# Altium project bms_mainboard-1_0.PrjPcb (part 4 of 7)

## Sheet usb_usb2534.SchDoc
size B
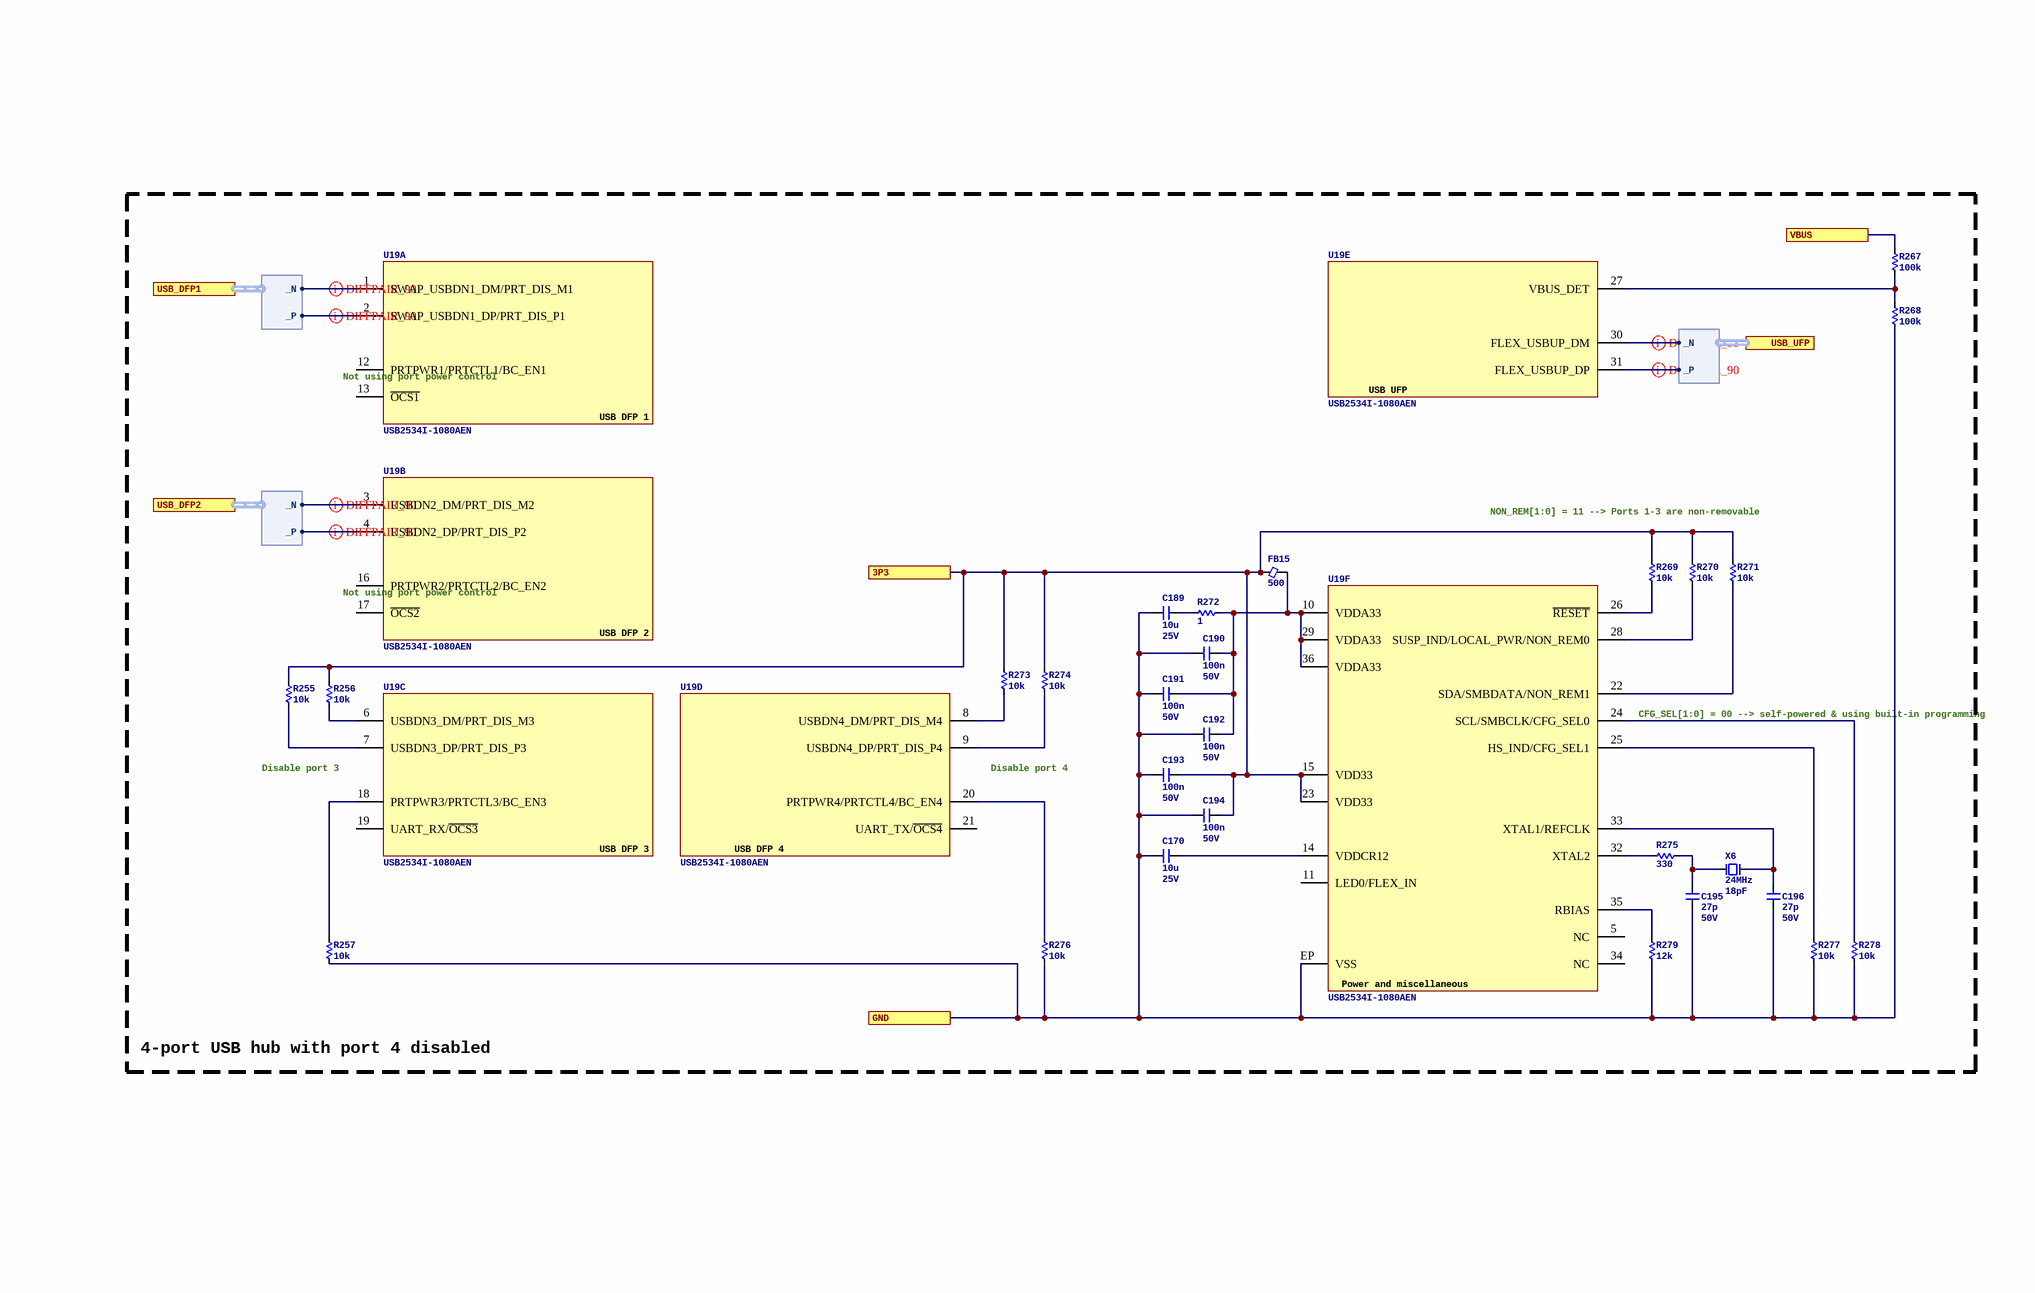
[diagram p16: usb_usb2534.SchDoc]

### Parts
C170  Capacitance: 10u  Voltage Rating: 25V  [C0603]  (hidden comment: CL10A106MA8NRNC)
C189  Capacitance: 10u  Voltage Rating: 25V  [C0805]  (hidden comment: CL21B106KAYQNNE)
C190  Capacitance: 100n  Voltage Rating: 50V  [C0402]  (hidden comment: CL05B104KB54PNC)
C191  Capacitance: 100n  Voltage Rating: 50V  [C0402]  (hidden comment: CL05B104KB54PNC)
C192  Capacitance: 100n  Voltage Rating: 50V  [C0402]  (hidden comment: CL05B104KB54PNC)
C193  Capacitance: 100n  Voltage Rating: 50V  [C0402]  (hidden comment: CL05B104KB54PNC)
C194  Capacitance: 100n  Voltage Rating: 50V  [C0402]  (hidden comment: CL05B104KB54PNC)
C195  Capacitance: 27p  Voltage Rating: 50V  [C0402]  (hidden comment: 0402CG270J500NT)
C196  Capacitance: 27p  Voltage Rating: 50V  [C0402]  (hidden comment: 0402CG270J500NT)
FB15  Current Rating (mA): 500  [FB0402]  (hidden comment: BLM15AX601SN1D)
R255  value 10k  [R0402]  (hidden comment: 0402WGF1002TCE)
R256  value 10k  [R0402]  (hidden comment: 0402WGF1002TCE)
R257  value 10k  [R0402]  (hidden comment: 0402WGF1002TCE)
R267  value 100k  [R0402]  (hidden comment: 0402WGF1003TCE)
R268  value 100k  [R0402]  (hidden comment: 0402WGF1003TCE)
R269  value 10k  [R0402]  (hidden comment: 0402WGF1002TCE)
R270  value 10k  [R0402]  (hidden comment: 0402WGF1002TCE)
R271  value 10k  [R0402]  (hidden comment: 0402WGF1002TCE)
R272  value 1  [R0402]  (hidden comment: CRCW04021R00FKED)
R273  value 10k  [R0402]  (hidden comment: 0402WGF1002TCE)
R274  value 10k  [R0402]  (hidden comment: 0402WGF1002TCE)
R275  value 330  [R0402]  (hidden comment: 0402WGF3300TCE)
R276  value 10k  [R0402]  (hidden comment: 0402WGF1002TCE)
R277  value 10k  [R0402]  (hidden comment: 0402WGF1002TCE)
R278  value 10k  [R0402]  (hidden comment: 0402WGF1002TCE)
R279  value 12k  [R0402]  (hidden comment: 0402WGF1202TCE)
U19  USB2534I-1080AEN  [QFN50P600X600X90-36N]  (parts A,B,C,D,E,F of 6)
X6  Frequency: 24MHz  Load Capacitance: 18pF  [XTAL_TXC_7A]  (hidden comment: 7A-24.000MAAJ-T)

### Ports
3P3, GND, USB_DFP1 (harness DIFF), USB_DFP2 (harness DIFF), USB_UFP (harness DIFF), VBUS

### Harnesses
DIFF: _N, _P

### Nets
3P3_USB: C193.1 C194.1 FB15.1 R255.1 R256.1 R269.1 R270.1 R271.1 R273.1 R274.1 U19.15(VDD33) U19.23(VDD33) ; port 3P3
GND: C170.2 C189.2 C190.2 C191.2 C192.2 C193.2 C194.2 C195.2 C196.2 R257.2 R268.1 R276.2 R277.2 R278.2 R279.2 U19.EP(VSS) ; port GND
VBUS: R267.1 ; port VBUS
USB_DFP1._N: U19.1(SWAP_USBDN1_DM/PRT_DIS_M1) ; port USB_DFP1._N
USB_DFP1._P: U19.2(SWAP_USBDN1_DP/PRT_DIS_P1) ; port USB_DFP1._P
USB_DFP2._N: U19.3(USBDN2_DM/PRT_DIS_M2) ; port USB_DFP2._N
USB_DFP2._P: U19.4(USBDN2_DP/PRT_DIS_P2) ; port USB_DFP2._P
USB_UFP._N: U19.30(FLEX_USBUP_DM) ; port USB_UFP._N
USB_UFP._P: U19.31(FLEX_USBUP_DP) ; port USB_UFP._P
NetC170_1: C170.1 U19.14(VDDCR12)
NetC189_1: C189.1 R272.2
NetC190_1: C190.1 C191.1 C192.1 FB15.2 R272.1 U19.10(VDDA33) U19.29(VDDA33) U19.36(VDDA33)
NetC195_1: C195.1 R275.1 X6.1
NetC196_1: C196.1 U19.33(XTAL1/REFCLK) X6.2
NetR255_2: R255.2 U19.7(USBDN3_DP/PRT_DIS_P3)
NetR256_2: R256.2 U19.6(USBDN3_DM/PRT_DIS_M3)
NetR257_1: R257.1 U19.18(PRTPWR3/PRTCTL3/BC_EN3)
NetR267_2: R267.2 R268.2 U19.27(VBUS_DET)
NetR269_2: R269.2 U19.26(~{RESET})
NetR270_2: R270.2 U19.28(SUSP_IND/LOCAL_PWR/NON_REM0)
NetR271_2: R271.2 U19.22(SDA/SMBDATA/NON_REM1)
NetR273_2: R273.2 U19.8(USBDN4_DM/PRT_DIS_M4)
NetR274_2: R274.2 U19.9(USBDN4_DP/PRT_DIS_P4)
NetR275_2: R275.2 U19.32(XTAL2)
NetR276_1: R276.1 U19.20(PRTPWR4/PRTCTL4/BC_EN4)
NetR277_1: R277.1 U19.25(HS_IND/CFG_SEL1)
NetR278_1: R278.1 U19.24(SCL/SMBCLK/CFG_SEL0)
NetR279_1: R279.1 U19.35(RBIAS)

Not connected (* = marked no-connect by the designer): U19 5(NC) 11(LED0/FLEX_IN) 12(PRTPWR1/PRTCTL1/BC_EN1) 13(~{OCS1}) 16(PRTPWR2/PRTCTL2/BC_EN2) 17(~{OCS2}) 19(UART_RX/~{OCS3}) 21(UART_TX/~{OCS4}) 34(NC)

### Layout directives
differential pair; differential pair class DE_90: USB_DFP1._N, USB_DFP1._P, USB_DFP2._N, USB_DFP2._P, USB_UFP._N, USB_UFP._P

### Notes on the sheet
- (near U19) Not using port power control
- NON_REM[1:0] = 11 --> Ports 1-3 are non-removable
- Disable port 3
- (near U19) Disable port 4
- (near U19) CFG_SEL[1:0] = 00 --> self-powered & using built-in programming
- 4-port USB hub with port 4 disabled
- (in symbol USB_HUB_4PORT_USB2534I-1080AEN, part A) USB DFP 1
- (in symbol USB_HUB_4PORT_USB2534I-1080AEN, part B) USB DFP 2
- (in symbol USB_HUB_4PORT_USB2534I-1080AEN, part C) USB DFP 3
- (in symbol USB_HUB_4PORT_USB2534I-1080AEN, part D) USB DFP 4
- (in symbol USB_HUB_4PORT_USB2534I-1080AEN, part E) USB UFP
- (in symbol USB_HUB_4PORT_USB2534I-1080AEN, part F) Power and miscellaneous
- (in symbol USB2534I-1080AEN, part A) USB DFP 1
- (in symbol USB2534I-1080AEN, part B) USB DFP 2
- (in symbol USB2534I-1080AEN, part C) USB DFP 3
- (in symbol USB2534I-1080AEN, part D) USB DFP 4
- (in symbol USB2534I-1080AEN, part E) USB UFP
- (in symbol USB2534I-1080AEN, part F) Power and miscellaneous

### Library data of the parts
C170 = CL10A106MA8NRNC: as C85 on sheet current_mp6519; ComponentLink1URL: https://wmsc.lcsc.com/wmsc/upload/file/pdf/v2/lcsc/2304140030_Samsung-Electro-Mechanics-CL10A106MA8NRNC_C96446.pdf; ComponentLink1Description: Datasheet; Manufacturer Part Number: CL10A106MA8NRNC; Package: 0603; Supplier 2: LCSC; Supplier Part Number 2: C96446
C189 = CL21B106KAYQNNE: as C38 on sheet adc_mcp3913; ComponentLink1URL: https://datasheet.lcsc.com/lcsc/2206222030_Samsung-Electro-Mechanics-CL21B106KAYQNNE_C3039694.pdf; ComponentLink1Description: Datasheet; Manufacturer Part Number: CL21B106KAYQNNE; Package: 0805; Supplier 2: LCSC; Supplier Part Number 2: C3039694
C190-C194 = CL05B104KB54PNC: as C37 on sheet adc_mcp3913; ComponentLink1URL: https://wmsc.lcsc.com/wmsc/upload/file/pdf/v2/lcsc/2304140030_Samsung-Electro-Mechanics-CL05B104KB54PNC_C307331.pdf; ComponentLink1Description: Datasheet; Manufacturer Part Number: CL05B104KB54PNC; Package: 0402; Supplier 2: LCSC; Supplier Part Number 2: C307331
C195 C196 = 0402CG270J500NT: as C34-C36 on sheet adc_mcp3913; ComponentLink1URL: https://wmsc.lcsc.com/wmsc/upload/file/pdf/v2/lcsc/2304140030_FH--Guangdong-Fenghua-Advanced-Tech-0402CG270J500NT_C1557.pdf; ComponentLink1Description: Datasheet; Manufacturer Part Number: 0402CG270J500NT; Package: 0402; Supplier 2: LCSC; Supplier Part Number 2: C1557
FB15 = BLM15AX601SN1D: as FB3 on sheet adc_mcp3913; ComponentLink1URL: https://wmsc.lcsc.com/wmsc/upload/file/pdf/v2/lcsc/2304140030_Murata-Electronics-BLM15AX601SN1D_C76886.pdf; ComponentLink1Description: Datasheet; Manufacturer Part Number: BLM15AX601SN1D; Supplier 2: LCSC; Supplier Part Number 2: C76886; Package: 0402
R255-R257 R269-R271 R273 R274 R276-R278 = 0402WGF1002TCE: as R75 on sheet adc_mcp3913; ComponentLink1Description: Datasheet; ComponentLink1URL: https://wmsc.lcsc.com/wmsc/upload/file/pdf/v2/lcsc/2206010100_UNI-ROYAL-Uniroyal-Elec-0402WGF1002TCE_C25744.pdf; Manufacturer Part Number: 0402WGF1002TCE; Package: 0402; Supplier 2: LCSC; Supplier Part Number 2: C25744
R267 R268 = 0402WGF1003TCE: as R141 on sheet current_mp6519; ComponentLink1Description: Datasheet; ComponentLink1URL: https://wmsc.lcsc.com/wmsc/upload/file/pdf/v2/lcsc/2206010100_UNI-ROYAL-Uniroyal-Elec-0402WGF1003TCE_C25741.pdf; Manufacturer Part Number: 0402WGF1003TCE; Package: 0402; Supplier 2: LCSC; Supplier Part Number 2: C25741
R272 = CRCW04021R00FKED: as R78 on sheet adc_mcp3913; ComponentLink1Description: Datasheet; ComponentLink1URL: https://wmsc.lcsc.com/wmsc/upload/file/pdf/v2/lcsc/2211030200_Vishay-Intertech-CRCW04021R00FKED_C482087.pdf; Manufacturer Part Number: CRCW04021R00FKED; Package: 0402; Supplier 2: LCSC; Supplier Part Number 2: C482087
R275 = 0402WGF3300TCE: Manufacturer: UNI-ROYAL(Uniroyal Elec); Tolerance: 1%; Temperature Coefficient: Â±100ppm/â„ƒ; Power Rating (mW): 62.5; ComponentLink1Description: Datasheet; ComponentLink1URL: https://wmsc.lcsc.com/wmsc/upload/file/pdf/v2/lcsc/2205311900_UNI-ROYAL-Uniroyal-Elec-0402WGF3300TCE_C25104.pdf; Manufacturer Part Number: 0402WGF3300TCE; Package: 0402; Supplier 2: LCSC; Supplier Part Number 2: C25104
R279 = 0402WGF1202TCE: Manufacturer: UNI-ROYAL(Uniroyal Elec); Tolerance: 1%; Temperature Coefficient: Â±100ppm/â„ƒ; Power Rating (mW): 62.5; ComponentLink1Description: Datasheet; ComponentLink1URL: https://wmsc.lcsc.com/wmsc/upload/file/pdf/v2/lcsc/2411221127_UNI-ROYAL-Uniroyal-Elec-0402WGF1202TCE_C25752.pdf; Manufacturer Part Number: 0402WGF1202TCE; Package: 0402; Supplier 2: LCSC; Supplier Part Number 2: C25752
U19 = USB_HUB_4PORT_USB2534I-1080AEN: USB Bus Controller, CMOS; Manufacturer: Microchip; Supplier 1: Digikey; Supplier Part Number 1: USB2534I-1080AEN-ND; Manufacturer Part Number: USB2534I-1080AEN; ComponentLink1Description: Datasheet; ComponentLink1URL: https://ww1.microchip.com/downloads/aemDocuments/documents/UNG/ProductDocuments/DataSheets/USB2534-Data-Sheet-DS00001713.pdf; ComponentLink2Description: Product page; ComponentLink2URL: https://www.microchip.com/en-us/product/USB2534; Supplier 2: LCSC; Supplier Part Number 2: C626674
X6 = XTAL_7A-24.000MAAJ-T: CRYSTAL 24.000 MHZ 18PF SMD; Manufacturer: TXC CORPORATION; Supplier 1: Digikey; ComponentLink1URL: http://www.txccrystal.com/images/pdf/7a.pdf; ComponentLink1Description: Datasheet; Supplier Part Number 1: 887-1090-1-ND; Manufacturer Part Number: 7A-24.000MAAJ-T; Supplier 2: LCSC; Supplier Part Number 2: C2450230

## Sheet conn_usbc.SchDoc
size A
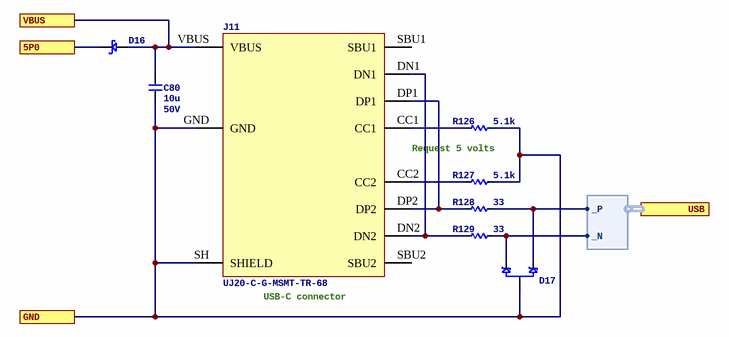
[diagram p17: conn_usbc.SchDoc]

### Parts
C80  Capacitance: 10u  Voltage Rating: 50V  [C1206]  (hidden comment: CL31B106KBHNNNE)
D16  MSS2P2-M3/89A  [ESMP]  (value not drawn)
D17  PESD2USB3UX  [3SOT23]  (value not drawn)
J11  UJ20-C-G-MSMT-TR-68  [CONN_USBC_UJ20-C-G-MSMT-TR-68]
R126  value 5.1k  [R0402]  (hidden comment: 0402WGF5101TCE)
R127  value 5.1k  [R0402]  (hidden comment: 0402WGF5101TCE)
R128  value 33  [R0402]  (hidden comment: 0402WGF330JTCE)
R129  value 33  [R0402]  (hidden comment: 0402WGF330JTCE)

### Ports
5P0, GND, USB (harness DIFF), VBUS

### Harnesses
DIFF: _P, _N

### Nets
5P0: D16.1 ; port 5P0
GND: C80.2 D17.3 J11.GND J11.SH(SHIELD) R126.1 R127.1 ; port GND
VBUS: C80.1 D16.2 J11.VBUS ; port VBUS
USB_UFP._N: D17.1 R129.1 ; port USB._N
USB_UFP._P: D17.2 R128.1 ; port USB._P
NetJ11_CC1: J11.CC1 R126.2
NetJ11_CC2: J11.CC2 R127.2
NetJ11_DN1: J11.DN1 J11.DN2 R129.2
NetJ11_DP1: J11.DP1 J11.DP2 R128.2

Not connected (* = marked no-connect by the designer): J11 SBU1 SBU2

### Notes on the sheet
- Request 5 volts
- (near J11) USB-C connector

### Library data of the parts
C80 = CL31B106KBHNNNE: Manufacturer: Samsung Electro-Mechanics; Dielectric: X7R; ComponentLink1URL: https://wmsc.lcsc.com/wmsc/upload/file/pdf/v2/lcsc/1810221111_Samsung-Electro-Mechanics-CL31B106KBHNNNE_C89632.pdf; ComponentLink1Description: Datasheet; Manufacturer Part Number: CL31B106KBHNNNE; Package: 1206; Supplier 2: LCSC; Supplier Part Number 2: C89632
D16 = SCHOTTKY_MSS2P2-M3/89A: as D20 on sheet current_mp6519; Supplier 1: Digikey; Manufacturer Part Number: MSS2P2-M3/89A; ComponentLink1URL: http://www.vishay.com/docs/89054/mss2p3.pdf; ComponentLink1Description: Datasheet; Supplier Part Number 1: MSS2P2-M3/89AGICT-ND; Supplier 2: LCSC; Supplier Part Number 2: C2978531
D17 = TVS_PESD2USB3UX-T: DIODE ESD USB SOT-23; Manufacturer: Nexperia USA Inc.; Supplier 1: Digikey; Supplier Part Number 1: 1727-PESD2USB3UX-CT-ND; Manufacturer Part Number: PESD2USB3UX; Supplier 2: LCSC; Supplier Part Number 2: C3708426; ComponentLink1Description: Datasheet; ComponentLink1URL: https://assets.nexperia.com/documents/data-sheet/PESD2USB3UX-T.pdf
J11 = CONN_USBC_UJ20-C-G-MSMT-TR-68: USB-C (USB TYPE-C) USB 2.0 Receptacle Connector 24 (16+8 Dummy) Position Surface Mount, Right Angle; Through Hole; Manufacturer: Same Sky; ComponentLink1Description: Product page; ComponentLink1URL: https://www.sameskydevices.com/product/interconnect/connectors/usb-connectors/uj20-c-g-msmt-tr-68; ComponentLink2Description: Drawing; ComponentLink2URL: https://www.sameskydevices.com/product/resource/uj20-c-g-msmt-tr-68.pdf; Supplier 1: Digikey; Supplier Part Number 1: 2223-UJ20-C-G-MSMT-TR-68CT-ND; Manufacturer Part Number: UJ20-C-G-MSMT-TR-68; Supplier 2: LCSC; Supplier Part Number 2: C21943923
R126 R127 = 0402WGF5101TCE: Manufacturer: UNI-ROYAL(Uniroyal Elec); Tolerance: 1%; Temperature Coefficient: Â±100ppm/â„ƒ; Power Rating (mW): 62.5; ComponentLink1Description: Datasheet; ComponentLink1URL: https://wmsc.lcsc.com/wmsc/upload/file/pdf/v2/lcsc/2206010045_UNI-ROYAL-Uniroyal-Elec-0402WGF5101TCE_C25905.pdf; Manufacturer Part Number: 0402WGF5101TCE; Package: 0402; Supplier 2: LCSC; Supplier Part Number 2: C25905
R128 R129 = 0402WGF330JTCE: as R74 on sheet adc_mcp3913; ComponentLink1Description: Datasheet; ComponentLink1URL: https://wmsc.lcsc.com/wmsc/upload/file/pdf/v2/lcsc/2205311900_UNI-ROYAL-Uniroyal-Elec-0402WGF330JTCE_C25105.pdf; Manufacturer Part Number: 0402WGF330JTCE; Package: 0402; Supplier 2: LCSC; Supplier Part Number 2: C25105

## Sheet st-link-v2.SchDoc
size C
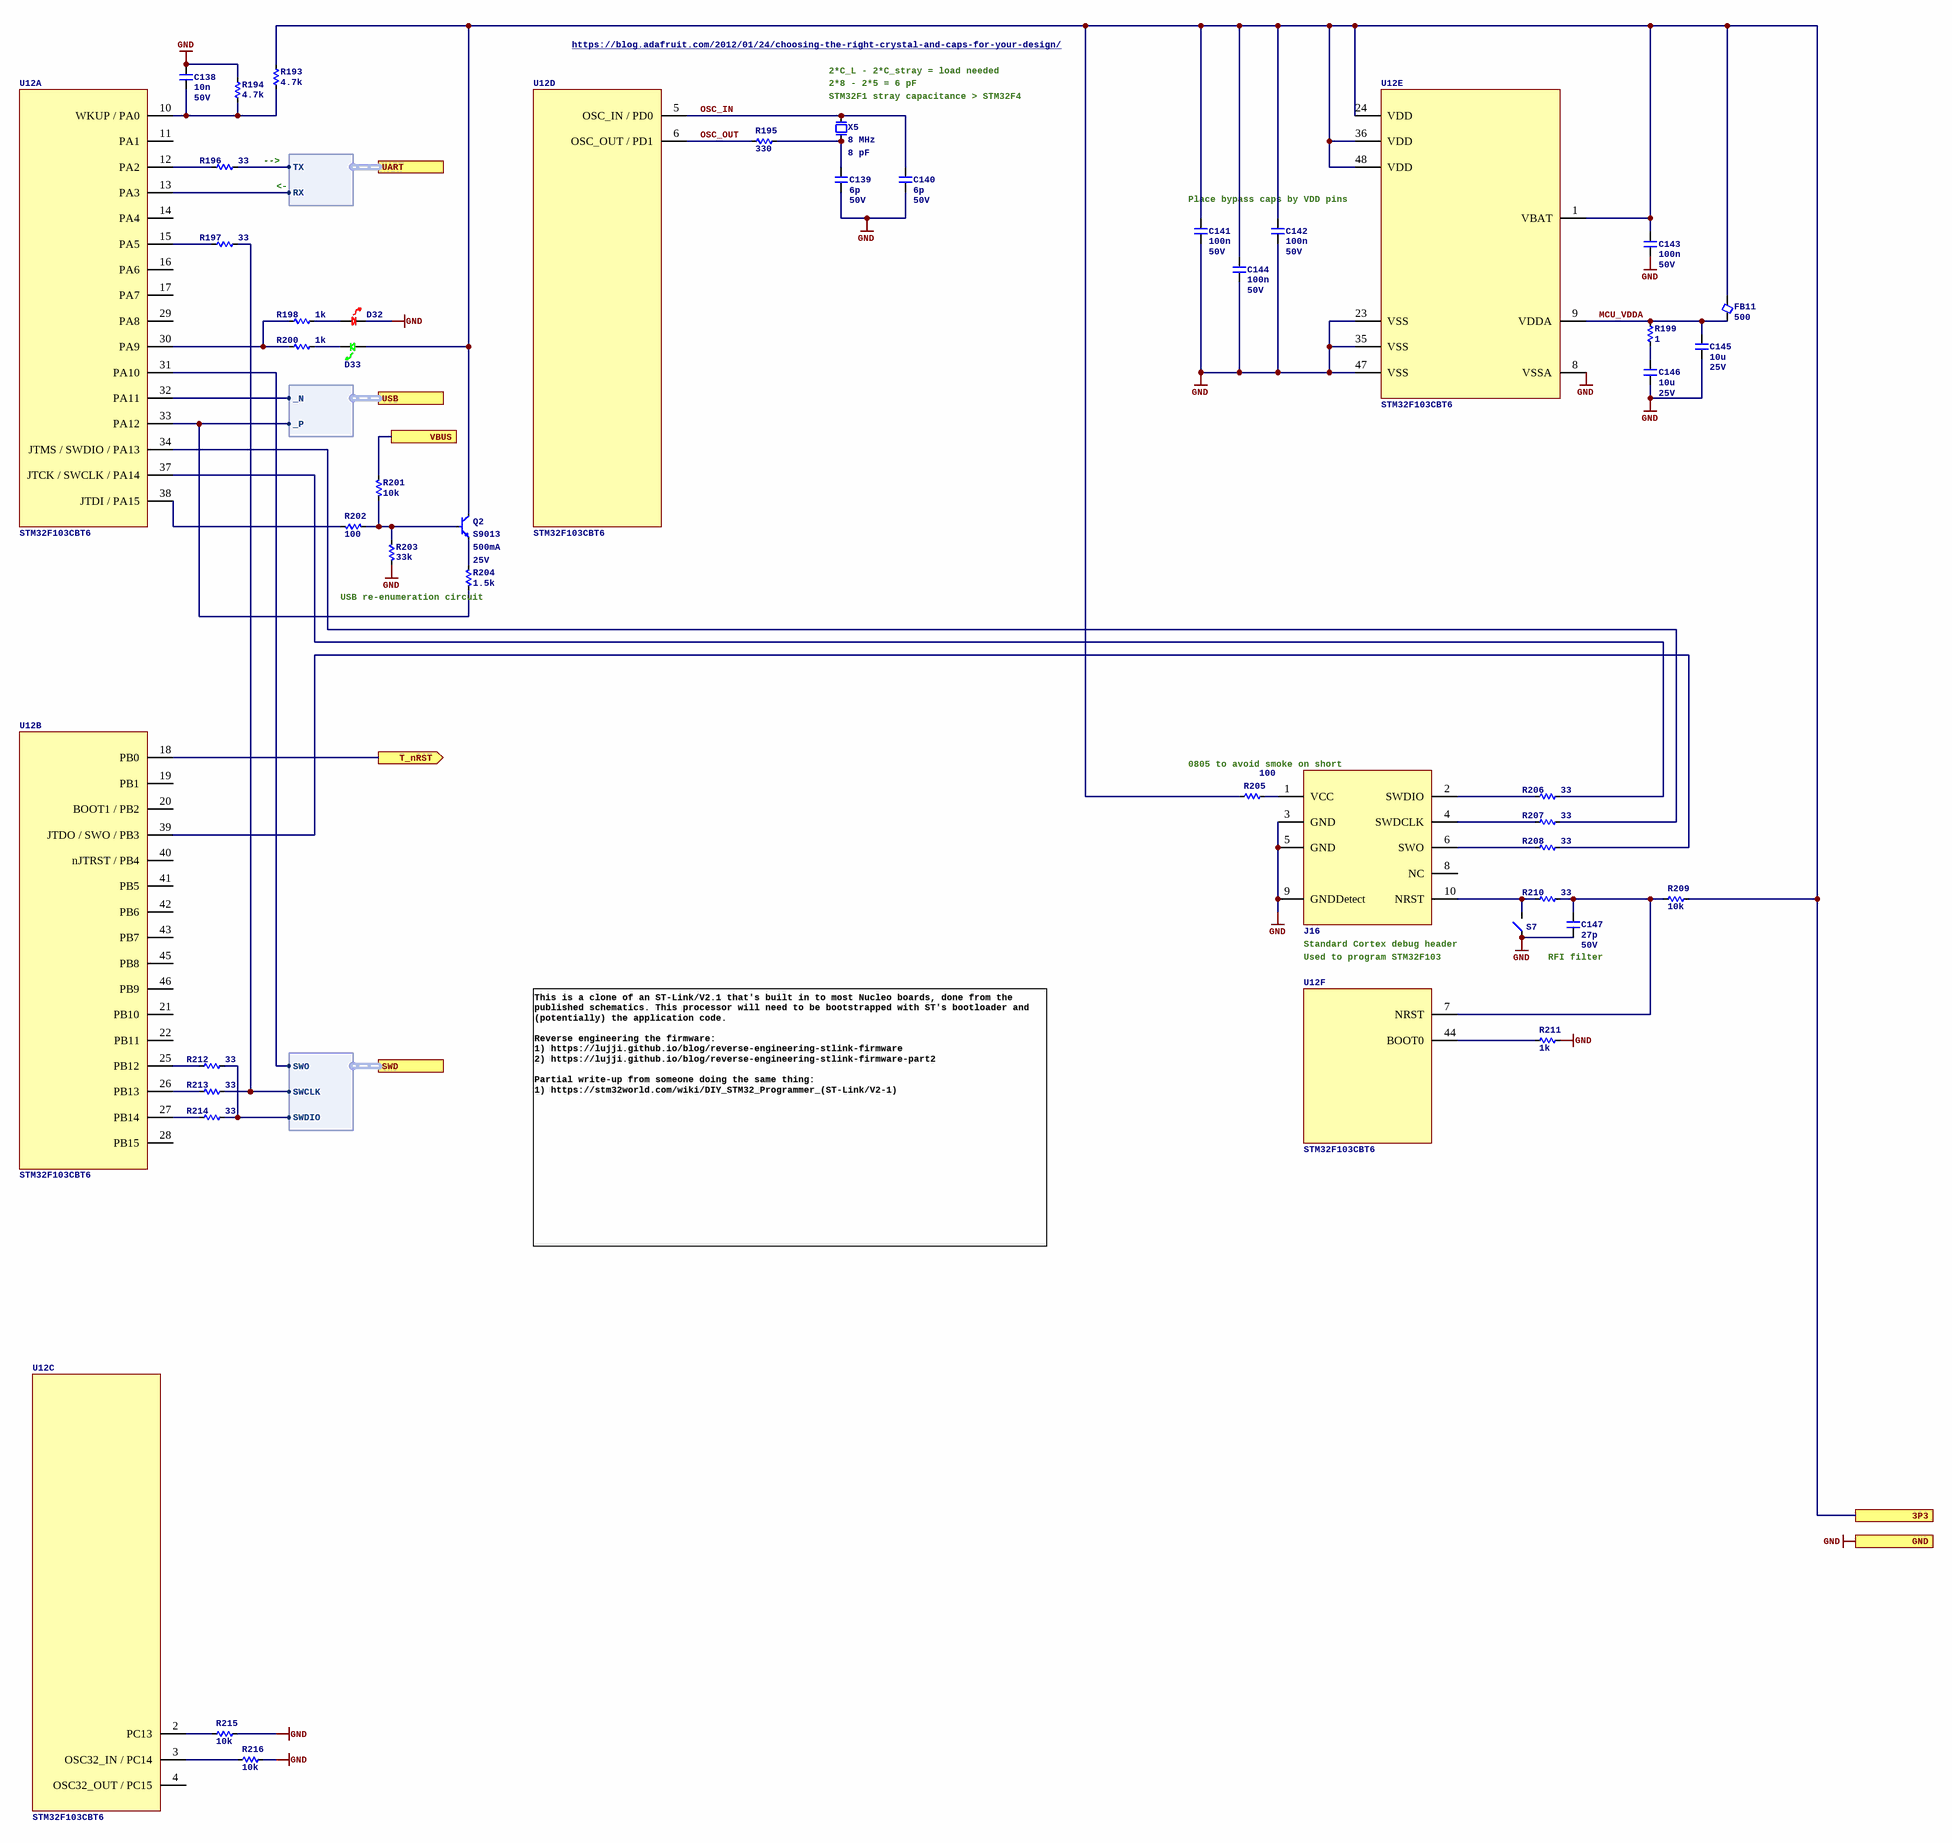
[diagram p18: st-link-v2.SchDoc]

### Parts
C138  Capacitance: 10n  Voltage Rating: 50V  [C0402]  (hidden comment: CL05B103KB5NNNC)
C139  Capacitance: 6p  Voltage Rating: 50V  [C0402]  (hidden comment: 0402CG6R0C500NT)
C140  Capacitance: 6p  Voltage Rating: 50V  [C0402]  (hidden comment: 0402CG6R0C500NT)
C141  Capacitance: 100n  Voltage Rating: 50V  [C0402]  (hidden comment: CL05B104KB54PNC)
C142  Capacitance: 100n  Voltage Rating: 50V  [C0402]  (hidden comment: CL05B104KB54PNC)
C143  Capacitance: 100n  Voltage Rating: 50V  [C0402]  (hidden comment: CL05B104KB54PNC)
C144  Capacitance: 100n  Voltage Rating: 50V  [C0402]  (hidden comment: CL05B104KB54PNC)
C145  Capacitance: 10u  Voltage Rating: 25V  [C0603]  (hidden comment: CL10A106MA8NRNC)
C146  Capacitance: 10u  Voltage Rating: 25V  [C0805]  (hidden comment: CL21B106KAYQNNE)
C147  Capacitance: 27p  Voltage Rating: 50V  [C0402]  (hidden comment: 0402CG270J500NT)
D32  LTST-C190KRKT  [LED_0603P_RED]  (value not drawn)
D33  LTST-C190GKT  [LED_0603P_GREEN]  (value not drawn)
FB11  Current Rating (mA): 500  [FB0402]  (hidden comment: BLM15AX601SN1D)
J16  FTSH-105-01-L-DV-K  [FTSH-105-01-L-DV-K_KEYED]  (value not drawn)
Q2  S9013  Current: 500mA  Voltage: 25V  [3SOT23]
R193  value 4.7k  [R0402]  (hidden comment: 0402WGF4701TCE)
R194  value 4.7k  [R0402]  (hidden comment: 0402WGF4701TCE)
R195  value 330  [R0402]  (hidden comment: 0402WGF3300TCE)
R196  value 33  [R0402]  (hidden comment: 0402WGF330JTCE)
R197  value 33  [R0402]  (hidden comment: 0402WGF330JTCE)
R198  value 1k  [R0402]  (hidden comment: 0402WGF1001TCE)
R199  value 1  [R0402]  (hidden comment: CRCW04021R00FKED)
R200  value 1k  [R0402]  (hidden comment: 0402WGF1001TCE)
R201  value 10k  [R0402]  (hidden comment: 0402WGF1002TCE)
R202  value 100  [R0402]  (hidden comment: RC0402FR-07100RL)
R203  value 33k  [R0402]  (hidden comment: 0402WGF3302TCE)
R204  value 1.5k  [R0402]  (hidden comment: 0402WGF1501TCE)
R205  value 100  [R0805]  (hidden comment: ERJP06F1000V)
R206  value 33  [R0402]  (hidden comment: 0402WGF330JTCE)
R207  value 33  [R0402]  (hidden comment: 0402WGF330JTCE)
R208  value 33  [R0402]  (hidden comment: 0402WGF330JTCE)
R209  value 10k  [R0402]  (hidden comment: 0402WGF1002TCE)
R210  value 33  [R0402]  (hidden comment: 0402WGF330JTCE)
R211  value 1k  [R0402]  (hidden comment: 0402WGF1001TCE)
R212  value 33  [R0402]  (hidden comment: 0402WGF330JTCE)
R213  value 33  [R0402]  (hidden comment: 0402WGF330JTCE)
R214  value 33  [R0402]  (hidden comment: 0402WGF330JTCE)
R215  value 10k  [R0402]  (hidden comment: 0402WGF1002TCE)
R216  value 10k  [R0402]  (hidden comment: 0402WGF1002TCE)
S7  TS-1092S-B3D2-G  [SWITCH_TS-1092S-B3D2-G]  (value not drawn)
U12  STM32F103CBT6  [48TQFP7]  (parts A,B,C,D,E,F of 6)
X5  Frequency: 8 MHz  Capacitance: 8 pF  [4_SMD_3.2X2.5MM]  (hidden comment: ECS-80-8-33Q-JES-TR)

### Ports
3P3, GND, SWD (harness SWD), T_nRST (out), UART (harness UART), USB (harness DIFF), VBUS

### Harnesses
DIFF: _P, _N
SWD: SWCLK, SWDIO, SWO
UART: RX, TX

### Nets
3P3_USB: C141.1 C142.1 C143.1 C144.1 D33.2 FB11.2 Q2.3(C) R193.2 R205.2 R209.1 U12.1(VBAT) U12.24(VDD) U12.36(VDD) U12.48(VDD) ; port 3P3
GND: C138.1 C139.2 C140.2 C141.2 C142.2 C143.2 C144.2 C145.2 C146.2 C147.2 D32.1 J16.3(GND) J16.5(GND) J16.9(GNDDetect) R194.2 R203.2 R211.2 R215.2 R216.2 S7.1 U12.8(VSSA) U12.23(VSS) U12.35(VSS) U12.47(VSS) ; port GND
VBUS: R201.1 ; port VBUS
MCU_nRST: U12.18(PB0) ; port T_nRST
MCU_VDDA: C145.1 FB11.1 R199.2 U12.9(VDDA)
OSC_IN: C140.1 U12.5(OSC_IN_/_PD0) X5.3
OSC_OUT: R195.1 U12.6(OSC_OUT_/_PD1)
SWD.SWCLK: R197.1 R213.1 ; port SWD.SWCLK
SWD.SWDIO: R212.1 R214.1 ; port SWD.SWDIO
SWD.SWO: U12.31(PA10) ; port SWD.SWO
UART7.RX: R196.1 ; port UART.TX
UART7.TX: U12.13(PA3) ; port UART.RX
USB_DFP2._N: U12.32(PA11) ; port USB._N
USB_DFP2._P: R204.2 U12.33(PA12) ; port USB._P
NetC138_2: C138.2 R193.1 R194.1 U12.10(WKUP_/_PA0)
NetC139_1: C139.1 R195.2 X5.1
NetC146_1: C146.1 R199.1
NetC147_1: C147.1 R209.2 R210.1 U12.7(NRST)
NetD32_2: D32.2 R198.1
NetD33_1: D33.1 R200.1
NetJ16_1: J16.1(VCC) R205.1
NetJ16_2: J16.2(SWDIO) R206.2
NetJ16_4: J16.4(SWDCLK) R207.2
NetJ16_6: J16.6(SWO) R208.2
NetJ16_10: J16.10(NRST) R210.2 S7.2
NetQ2_1: Q2.1(B) R201.2 R202.1 R203.1
NetQ2_2: Q2.2(E) R204.1
NetR196_2: R196.2 U12.12(PA2)
NetR197_2: R197.2 U12.15(PA5)
NetR198_2: R198.2 R200.2 U12.30(PA9)
NetR202_2: R202.2 U12.38(JTDI_/_PA15)
NetR206_1: R206.1 U12.37(JTCK_/_SWCLK_/_PA14)
NetR207_1: R207.1 U12.34(JTMS_/_SWDIO_/_PA13)
NetR208_1: R208.1 U12.39(JTDO_/_SWO_/_PB3)
NetR211_1: R211.1 U12.44(BOOT0)
NetR212_2: R212.2 U12.25(PB12)
NetR213_2: R213.2 U12.26(PB13)
NetR214_2: R214.2 U12.27(PB14)
NetR215_1: R215.1 U12.2(PC13)
NetR216_1: R216.1 U12.3(OSC32_IN_/_PC14)

Not connected (* = marked no-connect by the designer): J16 8(NC); U12 4(OSC32_OUT_/_PC15) 11(PA1) 14(PA4) 16(PA6) 17(PA7) 19(PB1) 20(BOOT1_/_PB2) 21(PB10) 22(PB11) 28(PB15) 29(PA8) 40(nJTRST_/_PB4) 41(PB5) 42(PB6) 43(PB7) 45(PB8) 46(PB9)

### Notes on the sheet
- https://blog.adafruit.com/2012/01/24/choosing-the-right-crystal-and-caps-for-your-design/
- (near X5) 2*C_L - 2*C_stray = load needed
- (near X5) 2*8 - 2*5 = 6 pF
- (near X5) STM32F1 stray capacitance > STM32F4
- (near R196) -->
- (near R196) <--
- Place bypass caps by VDD pins
- (near R204) USB re-enumeration circuit
- 0805 to avoid smoke on short
- Standard Cortex debug header
- Used to program STM32F103
- RFI filter
- This is a clone of an ST-Link/V2.1 that's built in to most Nucleo boards, done from the published schematics. This processor will need to be bootstrapped with ST's bootloader and (potentially) the application code.
  Reverse engineering the firmware:
  1) https://lujji.github.io/blog/reverse-engineering-stlink-firmware
  2) https://lujji.github.io/blog/reverse-engineering-stlink-firmware-part2
  Partial write-up from someone doing the same thing:
  1) https://stm32world.com/wiki/DIY_STM32_Programmer_(ST-Link/V2-1)

### Library data of the parts
C138 = CL05B103KB5NNNC: Manufacturer: Samsung Electro-Mechanics; Dielectric: X7R; ComponentLink1URL: https://wmsc.lcsc.com/wmsc/upload/file/pdf/v2/lcsc/2304140030_Samsung-Electro-Mechanics-CL05B103KB5NNNC_C15195.pdf; ComponentLink1Description: Datasheet; Manufacturer Part Number: CL05B103KB5NNNC; Package: 0402; Supplier 2: LCSC; Supplier Part Number 2: C15195
C139 C140 = 0402CG6R0C500NT: Manufacturer: FH(Guangdong Fenghua Advanced Tech); Dielectric: C0G; ComponentLink1URL: https://wmsc.lcsc.com/wmsc/upload/file/pdf/v2/lcsc/2304140030_FH--Guangdong-Fenghua-Advanced-Tech-0402CG6R0C500NT_C1575.pdf; ComponentLink1Description: Datasheet; Manufacturer Part Number: 0402CG6R0C500NT; Package: 0402; Supplier 2: LCSC; Supplier Part Number 2: C1575
C141-C144 = CL05B104KB54PNC: as C37 on sheet adc_mcp3913; ComponentLink1URL: https://wmsc.lcsc.com/wmsc/upload/file/pdf/v2/lcsc/2304140030_Samsung-Electro-Mechanics-CL05B104KB54PNC_C307331.pdf; ComponentLink1Description: Datasheet; Manufacturer Part Number: CL05B104KB54PNC; Package: 0402; Supplier 2: LCSC; Supplier Part Number 2: C307331
C145 = CL10A106MA8NRNC: as C85 on sheet current_mp6519; ComponentLink1URL: https://wmsc.lcsc.com/wmsc/upload/file/pdf/v2/lcsc/2304140030_Samsung-Electro-Mechanics-CL10A106MA8NRNC_C96446.pdf; ComponentLink1Description: Datasheet; Manufacturer Part Number: CL10A106MA8NRNC; Package: 0603; Supplier 2: LCSC; Supplier Part Number 2: C96446
C146 = CL21B106KAYQNNE: as C38 on sheet adc_mcp3913; ComponentLink1URL: https://datasheet.lcsc.com/lcsc/2206222030_Samsung-Electro-Mechanics-CL21B106KAYQNNE_C3039694.pdf; ComponentLink1Description: Datasheet; Manufacturer Part Number: CL21B106KAYQNNE; Package: 0805; Supplier 2: LCSC; Supplier Part Number 2: C3039694
C147 = 0402CG270J500NT: as C34-C36 on sheet adc_mcp3913; ComponentLink1URL: https://wmsc.lcsc.com/wmsc/upload/file/pdf/v2/lcsc/2304140030_FH--Guangdong-Fenghua-Advanced-Tech-0402CG270J500NT_C1557.pdf; ComponentLink1Description: Datasheet; Manufacturer Part Number: 0402CG270J500NT; Package: 0402; Supplier 2: LCSC; Supplier Part Number 2: C1557
D32 = LED_0603_RED_LTST-C190KRKT: as D19 on sheet current_mp6519; ComponentLink1URL: https://optoelectronics.liteon.com/upload/download/DS-22-99-0151/LTST-C190KRKT.pdf; ComponentLink1Description: Datasheet; Supplier 1: Digikey; Supplier Part Number 1: 160-1436-1-ND; Manufacturer Part Number: LTST-C190KRKT; Supplier 2: LCSC; Supplier Part Number 2: C94869
D33 = LED_0603_GREEN_LTST-C190GKT: LED GREEN CLEAR 0603 SMD; Manufacturer: Lite-On Inc; Supplier 1: Digikey; ComponentLink1URL: https://mm.digikey.com/Volume0/opasdata/d220001/medias/docus/858/LTST-C190GKT.pdf; ComponentLink1Description: Datasheet; Supplier Part Number 1: 160-1183-1-ND; Manufacturer Part Number: LTST-C190GKT; Supplier 2: LCSC; Supplier Part Number 2: C125093
FB11 = BLM15AX601SN1D: as FB3 on sheet adc_mcp3913; ComponentLink1URL: https://wmsc.lcsc.com/wmsc/upload/file/pdf/v2/lcsc/2304140030_Murata-Electronics-BLM15AX601SN1D_C76886.pdf; ComponentLink1Description: Datasheet; Manufacturer Part Number: BLM15AX601SN1D; Supplier 2: LCSC; Supplier Part Number 2: C76886; Package: 0402
J16 = CONN_SWD_CORTEX_DEBUG: CONN HEADER 10 POS DUAL .05" SMD; Manufacturer: Samtec Inc; Supplier 1: Digikey; ComponentLink1URL: http://www.samtec.com/documents/webfiles/cpdf/FTSH-1XX-XX-XXX-DV-XXX-MKT.pdf; ComponentLink1Description: Datasheet; Supplier Part Number 1: FTSH-105-01-L-DV-K-ND; Manufacturer Part Number: FTSH-105-01-L-DV-K; Supplier 2: LCSC; Supplier Part Number 2: C448647
Q2 = NPN_25V_S9013: Bipolar (BJT) Transistor NPN 25 V 500 mA 150MHz 300 mW Surface Mount SOT-23; Manufacturer: Shenzhen Slkormicro Semicon Co., Ltd.; Supplier 1: Digikey; Supplier Part Number 1: 5399-S9013CT-ND; Manufacturer Part Number: S9013; ComponentLink1Description: Datasheet; ComponentLink1URL: https://www.onsemi.com/pdf/datasheet/nss1c201mz4-d.pdf; Supplier 2: LCSC; Supplier Part Number 2: C431712
R193 R194 = 0402WGF4701TCE: as R118 on sheet conn_fan; ComponentLink1Description: Datasheet; ComponentLink1URL: https://wmsc.lcsc.com/wmsc/upload/file/pdf/v2/lcsc/2206010045_UNI-ROYAL-Uniroyal-Elec-0402WGF4701TCE_C25900.pdf; Manufacturer Part Number: 0402WGF4701TCE; Package: 0402; Supplier 2: LCSC; Supplier Part Number 2: C25900
R195 = 0402WGF3300TCE: as R275 on sheet usb_usb2534; ComponentLink1Description: Datasheet; ComponentLink1URL: https://wmsc.lcsc.com/wmsc/upload/file/pdf/v2/lcsc/2205311900_UNI-ROYAL-Uniroyal-Elec-0402WGF3300TCE_C25104.pdf; Manufacturer Part Number: 0402WGF3300TCE; Package: 0402; Supplier 2: LCSC; Supplier Part Number 2: C25104
R196 R197 R206-R208 R210 R212-R214 = 0402WGF330JTCE: as R74 on sheet adc_mcp3913; ComponentLink1Description: Datasheet; ComponentLink1URL: https://wmsc.lcsc.com/wmsc/upload/file/pdf/v2/lcsc/2205311900_UNI-ROYAL-Uniroyal-Elec-0402WGF330JTCE_C25105.pdf; Manufacturer Part Number: 0402WGF330JTCE; Package: 0402; Supplier 2: LCSC; Supplier Part Number 2: C25105
R198 R200 R211 = 0402WGF1001TCE: as R104 on sheet filter_diff_shunt; ComponentLink1Description: Datasheet; ComponentLink1URL: https://wmsc.lcsc.com/wmsc/upload/file/pdf/v2/lcsc/2206010216_UNI-ROYAL-Uniroyal-Elec-0402WGF1001TCE_C11702.pdf; Manufacturer Part Number: 0402WGF1001TCE; Package: 0402; Supplier 2: LCSC; Supplier Part Number 2: C11702
R199 = CRCW04021R00FKED: as R78 on sheet adc_mcp3913; ComponentLink1Description: Datasheet; ComponentLink1URL: https://wmsc.lcsc.com/wmsc/upload/file/pdf/v2/lcsc/2211030200_Vishay-Intertech-CRCW04021R00FKED_C482087.pdf; Manufacturer Part Number: CRCW04021R00FKED; Package: 0402; Supplier 2: LCSC; Supplier Part Number 2: C482087
R201 R209 R215 R216 = 0402WGF1002TCE: as R75 on sheet adc_mcp3913; ComponentLink1Description: Datasheet; ComponentLink1URL: https://wmsc.lcsc.com/wmsc/upload/file/pdf/v2/lcsc/2206010100_UNI-ROYAL-Uniroyal-Elec-0402WGF1002TCE_C25744.pdf; Manufacturer Part Number: 0402WGF1002TCE; Package: 0402; Supplier 2: LCSC; Supplier Part Number 2: C25744
R202 = RC0402FR-07100RL: Manufacturer: YAGEO; Tolerance: 1%; Temperature Coefficient: Â±100ppm/â„ƒ; Power Rating (mW): 62.5; ComponentLink1Description: Datasheet; ComponentLink1URL: https://wmsc.lcsc.com/wmsc/upload/file/pdf/v2/lcsc/2304140030_YAGEO-RC0402FR-07100RL_C106232.pdf; Manufacturer Part Number: RC0402FR-07100RL; Package: 0402; Supplier 2: LCSC; Supplier Part Number 2: C106232
R203 = 0402WGF3302TCE: Manufacturer: UNI-ROYAL(Uniroyal Elec); Tolerance: 1%; Temperature Coefficient: Â±100ppm/â„ƒ; Power Rating (mW): 62.5; ComponentLink1Description: Datasheet; ComponentLink1URL: https://wmsc.lcsc.com/wmsc/upload/file/pdf/v2/lcsc/2206010100_UNI-ROYAL-Uniroyal-Elec-0402WGF3302TCE_C25779.pdf; Manufacturer Part Number: 0402WGF3302TCE; Package: 0402; Supplier 2: LCSC; Supplier Part Number 2: C25779
R204 = 0402WGF1501TCE: Manufacturer: UNI-ROYAL(Uniroyal Elec); Tolerance: 1%; Temperature Coefficient: Â±100ppm/â„ƒ; Power Rating (mW): 62.5; ComponentLink1Description: Datasheet; ComponentLink1URL: https://wmsc.lcsc.com/wmsc/upload/file/pdf/v2/lcsc/2206010045_UNI-ROYAL-Uniroyal-Elec-0402WGF1501TCE_C25867.pdf; Manufacturer Part Number: 0402WGF1501TCE; Package: 0402; Supplier 2: LCSC; Supplier Part Number 2: C25867
R205 = ERJP06F1000V: Manufacturer: PANASONIC; Tolerance: 1%; Temperature Coefficient: Â±100ppm/â„ƒ; Power Rating (mW): 500; ComponentLink1Description: Datasheet; ComponentLink1URL: https://wmsc.lcsc.com/wmsc/upload/file/pdf/v2/lcsc/2404150944_PANASONIC-ERJP06F1000V_C441975.pdf; Manufacturer Part Number: ERJP06F1000V; Package: 0805; Supplier 2: LCSC; Supplier Part Number 2: C441975
S7 = SWITCH_TS-1092S-B3D2-G: SWITCH TACTILE SPST-NO; Manufacturer: Yuandi; Supplier 1: LCSC; Supplier Part Number 1: C520860; Manufacturer Part Number: TS-1092S-B3D2-G; ComponentLink1Description: Datasheet; ComponentLink1URL: https://www.lcsc.com/datasheet/lcsc_datasheet_2005071437_Yuandi-TS-1092S-B3D2-G_C520860.pdf
U12 = MCU_STM32F103CBT6: ARM Cortex-M3 STM32 F1 Microcontroller 32-Bit 72MHz 128kB FLASH LQFP48 STM32F103CBT6; Manufacturer: STMicroelectronics; Supplier 1: Digikey; Supplier Part Number 1: 497-6288-ND; Manufacturer Part Number: STM32F103CBT6; ComponentLink1Description: Datasheet; ComponentLink1URL: https://www.st.com/resource/en/datasheet/stm32f103cb.pdf; ComponentLink2Description: Reference Manual; ComponentLink2URL: https://www.st.com/resource/en/reference_manual/rm0008-stm32f101xx-stm32f102xx-stm32f103xx-stm32f105xx-and-stm32f107xx-advanced-armbased-32bit-mcus-stmicroelectronics.pdf; Supplier 2: LCSC; Supplier Part Number 2: C8304
X5 = XTAL_8MHZ_ECS-80-8-33Q-JES-TR: 8 MHz ±20ppm Crystal 8pF 500 Ohms 4-SMD, No Lead; Manufacturer: ECS Inc.; Supplier 1: Digikey; Supplier Part Number 1: 50-ECS-80-8-33Q-JES-TRCT-ND; Manufacturer Part Number: ECS-80-8-33Q-JES-TR; Supplier 2: LCSC; Supplier Part Number 2: C5727442; ComponentLink1Description: Datasheet; ComponentLink1URL: https://www.murata.com/products/productdata/8801076543518/SPEC-XRCGB25M000F3A00R0.pdf

## Sheet conn_harness_lv.SchDoc
size B
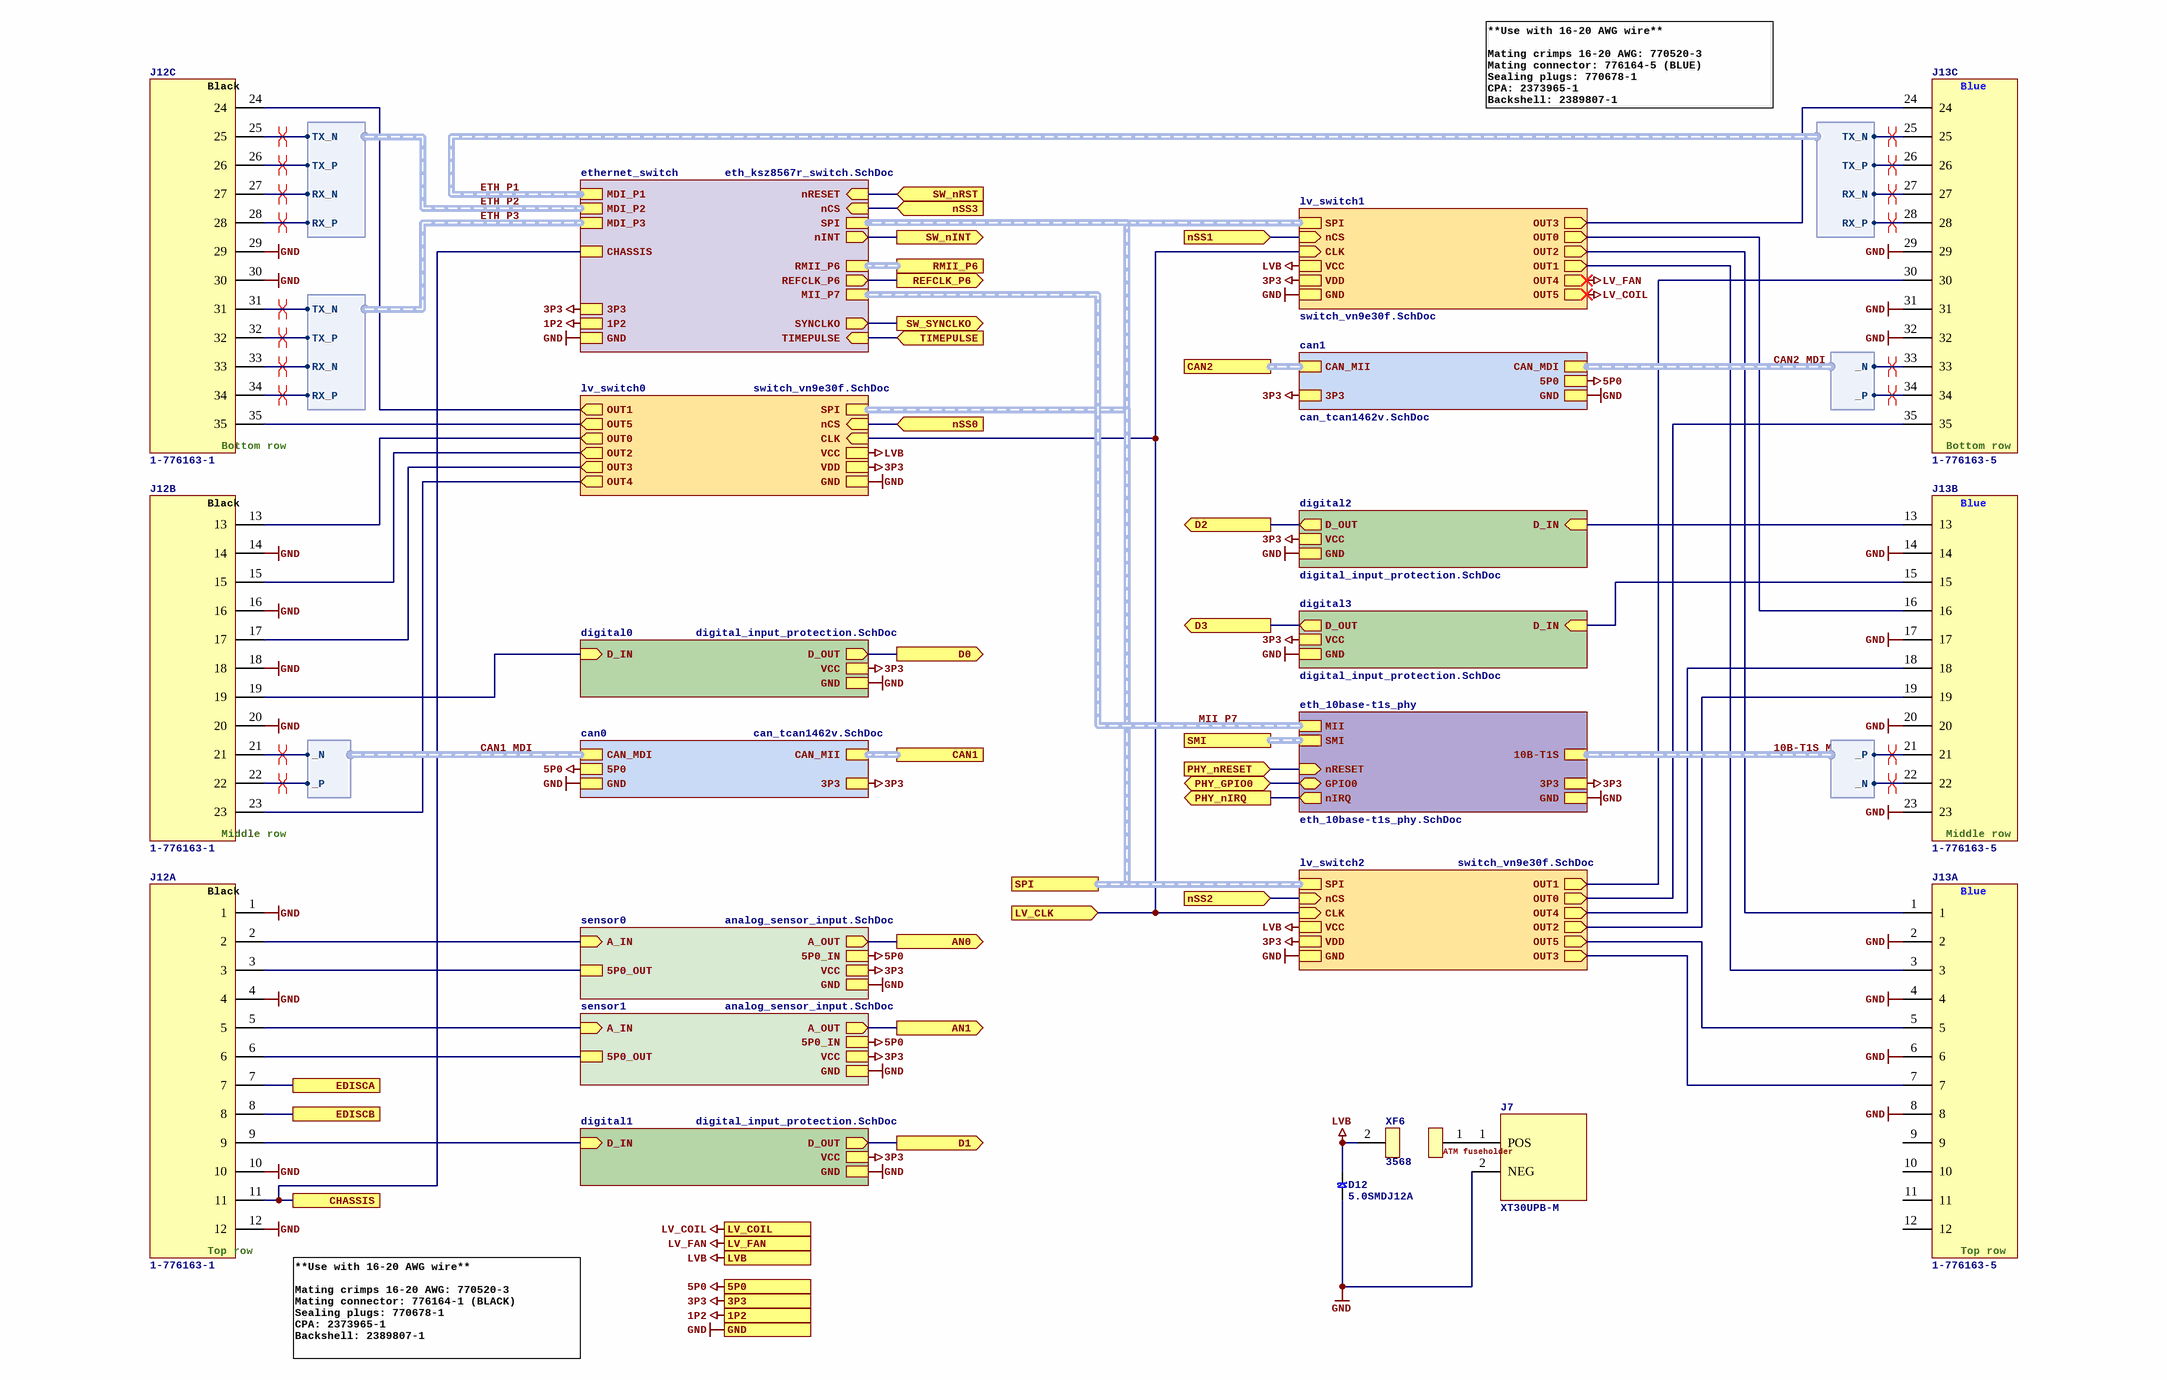
[diagram p19: conn_harness_lv.SchDoc]

### Parts
D12  5.0SMDJ12A  [SMC]
J7  XT30UPB-M  [AMASS_XT30UPB-M]
J12  1-776163-1  [TE_AMPSEAL_1-776163-1]  (parts A,B,C of 3)
J13  1-776163-5  [TE_AMPSEAL_1-776163-5]  (parts A,B,C of 3)
XF6  3568  [FUSEHOLDER_KEYSTONE_3568]

### Sub-sheets
can0 = can_tcan1462v.SchDoc: GND, 5P0, CAN_MII (harness CAN), CAN_MDI (harness DIFF), 3P3
can1 = can_tcan1462v.SchDoc: GND, 5P0, CAN_MII (harness CAN), CAN_MDI (harness DIFF), 3P3
digital0 = digital_input_protection.SchDoc: D_OUT (out), D_IN (in), GND, VCC
digital1 = digital_input_protection.SchDoc: D_OUT (out), D_IN (in), GND, VCC
digital2 = digital_input_protection.SchDoc: D_OUT (out), D_IN (in), GND, VCC
digital3 = digital_input_protection.SchDoc: D_OUT (out), D_IN (in), GND, VCC
eth_10base-t1s_phy = eth_10base-t1s_phy.SchDoc: MII (harness MII), SMI (harness SMI), nRESET (in), GND, 3P3, GPIO0 (bidir), nIRQ (out), 10B-T1S (harness DIFF)
ethernet_switch = eth_ksz8567r_switch.SchDoc: nRESET (in), MDI_P1 (harness 100BASE-TX), MDI_P2 (harness 100BASE-TX), MDI_P3 (harness 100BASE-TX), GND, 1P2, 3P3, CHASSIS, RMII_P6 (harness RMII), REFCLK_P6 (out), TIMEPULSE (in), MII_P7 (harness MII), SPI (harness SPI), nCS (in), nINT (out), SYNCLKO (out)
lv_switch0 = switch_vn9e30f.SchDoc: OUT0 (out), OUT1 (out), OUT2 (out), OUT3 (out), OUT4 (out), OUT5 (out), VCC, GND, VDD, SPI (harness SPI), nCS (in), CLK (in)
lv_switch1 = switch_vn9e30f.SchDoc: OUT0 (out), OUT1 (out), OUT2 (out), OUT3 (out), OUT4 (out), OUT5 (out), VCC, GND, VDD, SPI (harness SPI), nCS (in), CLK (in)
lv_switch2 = switch_vn9e30f.SchDoc: OUT0 (out), OUT1 (out), OUT2 (out), OUT3 (out), OUT4 (out), OUT5 (out), VCC, GND, VDD, SPI (harness SPI), nCS (in), CLK (in)
sensor0 = analog_sensor_input.SchDoc: A_OUT (out), A_IN (in), 5P0_IN, GND, 5P0_OUT, VCC
sensor1 = analog_sensor_input.SchDoc: A_OUT (out), A_IN (in), 5P0_IN, GND, 5P0_OUT, VCC

### Ports
1P2, 3P3, 5P0, AN0 (out), AN1 (out), CAN1 (harness CAN), CAN2 (harness CAN), CHASSIS, D0 (out), D1 (out), D2 (out), D3 (out), EDISCA, EDISCB, GND, LV_CLK (in), LV_COIL, LV_FAN, LVB, nSS0 (in), nSS1 (in), nSS2 (in), nSS3 (in), PHY_GPIO0 (bidir), PHY_nIRQ (out), PHY_nRESET (in), REFCLK_P6 (out), RMII_P6 (harness RMII), SMI (harness SMI), SPI (harness SPI), SW_nINT (out), SW_nRST (in), SW_SYNCLKO (out), TIMEPULSE (in)

### Harnesses
DIFF: _P, _N
100BASE-TX: TX_N, TX_P, RX_N, RX_P

### Nets
1P2: port 1P2, sheet ethernet_switch/1P2
3P3: port 3P3, sheet can1/3P3, sheet can0/3P3, sheet ethernet_switch/3P3, sheet lv_switch0/VDD, sheet lv_switch1/VDD, sheet lv_switch2/VDD, sheet sensor0/VCC, sheet sensor1/VCC, sheet digital0/VCC, sheet digital1/VCC, sheet digital2/VCC, sheet digital3/VCC, sheet eth_10base-t1s_phy/3P3
5P0: port 5P0, sheet can1/5P0, sheet can0/5P0, sheet sensor0/5P0_IN, sheet sensor1/5P0_IN
CHASSIS: J12.11 ; port CHASSIS, sheet ethernet_switch/CHASSIS
GND: D12.1 J7.2(NEG) J12.1 J12.4 J12.10 J12.12 J12.14 J12.16 J12.18 J12.20 J12.29 J12.30 J13.2 J13.4 J13.6 J13.8 J13.14 J13.17 J13.20 J13.23 J13.29 J13.31 J13.32 ; port GND, sheet can1/GND, sheet can0/GND, sheet ethernet_switch/GND, sheet lv_switch0/GND, sheet lv_switch1/GND, sheet lv_switch2/GND, sheet sensor0/GND, sheet sensor1/GND, sheet digital0/GND, sheet digital1/GND, sheet digital2/GND, sheet digital3/GND, sheet eth_10base-t1s_phy/GND
LV_COIL: port LV_COIL, sheet lv_switch1/OUT5
LV_FAN: port LV_FAN, sheet lv_switch1/OUT4
LVB: D12.2 XF6.2 ; port LVB, sheet lv_switch0/VCC, sheet lv_switch1/VCC, sheet lv_switch2/VCC
10B-T1S_MDI._N: J13.22 ; sheet eth_10base-t1s_phy/10B-T1S._N
10B-T1S_MDI._P: J13.21 ; sheet eth_10base-t1s_phy/10B-T1S._P
AIN0: port AN0, sheet sensor0/A_OUT
AIN1: port AN1, sheet sensor1/A_OUT
CAN1_MDI._N: J12.21 ; sheet can0/CAN_MDI._N
CAN1_MDI._P: J12.22 ; sheet can0/CAN_MDI._P
CAN2_MDI._N: J13.33 ; sheet can1/CAN_MDI._N
CAN2_MDI._P: J13.34 ; sheet can1/CAN_MDI._P
DIN0: port D0, sheet digital0/D_OUT
DIN1: port D1, sheet digital1/D_OUT
DIN2: port D2, sheet digital2/D_OUT
DIN3: port D3, sheet digital3/D_OUT
EDISC_A: J12.7 ; port EDISCA
EDISC_B: J12.8 ; port EDISCB
ETH_P1.RX_N: J13.27 ; sheet ethernet_switch/MDI_P1.RX_N
ETH_P1.RX_P: J13.28 ; sheet ethernet_switch/MDI_P1.RX_P
ETH_P1.TX_N: J13.25 ; sheet ethernet_switch/MDI_P1.TX_N
ETH_P1.TX_P: J13.26 ; sheet ethernet_switch/MDI_P1.TX_P
ETH_P2.RX_N: J12.27 ; sheet ethernet_switch/MDI_P2.RX_N
ETH_P2.RX_P: J12.28 ; sheet ethernet_switch/MDI_P2.RX_P
ETH_P2.TX_N: J12.25 ; sheet ethernet_switch/MDI_P2.TX_N
ETH_P2.TX_P: J12.26 ; sheet ethernet_switch/MDI_P2.TX_P
ETH_P3.RX_N: J12.33 ; sheet ethernet_switch/MDI_P3.RX_N
ETH_P3.RX_P: J12.34 ; sheet ethernet_switch/MDI_P3.RX_P
ETH_P3.TX_N: J12.31 ; sheet ethernet_switch/MDI_P3.TX_N
ETH_P3.TX_P: J12.32 ; sheet ethernet_switch/MDI_P3.TX_P
ETH_REFCLK: port REFCLK_P6, sheet ethernet_switch/REFCLK_P6
ETH_SWITCH_nINT: port SW_nINT, sheet ethernet_switch/nINT
ETH_SWITCH_nRST: port SW_nRST, sheet ethernet_switch/nRESET
ETH_SWITCH_nSS3: port nSS3, sheet ethernet_switch/nCS
ETH_SWITCH_SYNCLKO: port SW_SYNCLKO, sheet ethernet_switch/SYNCLKO
LV_nSS0: port nSS0, sheet lv_switch0/nCS
LV_nSS1: port nSS1, sheet lv_switch1/nCS
LV_nSS2: port nSS2, sheet lv_switch2/nCS
LV_PWM_CLK: port LV_CLK, sheet lv_switch0/CLK, sheet lv_switch1/CLK, sheet lv_switch2/CLK
PHY_GPIO0: port PHY_GPIO0, sheet eth_10base-t1s_phy/GPIO0
PHY_nIRQ: port PHY_nIRQ, sheet eth_10base-t1s_phy/nIRQ
PHY_nRESET: port PHY_nRESET, sheet eth_10base-t1s_phy/nRESET
TIMEPULSE: port TIMEPULSE, sheet ethernet_switch/TIMEPULSE
NetC148A_1: J12.3 ; sheet sensor0/5P0_OUT
NetC148B_1: J12.6 ; sheet sensor1/5P0_OUT
NetC150A_1: J12.13 ; sheet lv_switch0/OUT0
NetC150B_1: J13.16 ; sheet lv_switch1/OUT0
NetC150C_1: J13.35 ; sheet lv_switch2/OUT0
NetC151A_1: J12.24 ; sheet lv_switch0/OUT1
NetC151B_1: J13.3 ; sheet lv_switch1/OUT1
NetC151C_1: J13.30 ; sheet lv_switch2/OUT1
NetC154A_1: J12.15 ; sheet lv_switch0/OUT2
NetC154B_1: J13.1 ; sheet lv_switch1/OUT2
NetC154C_1: J13.19 ; sheet lv_switch2/OUT2
NetC155A_1: J12.17 ; sheet lv_switch0/OUT3
NetC155B_1: J13.24 ; sheet lv_switch1/OUT3
NetC155C_1: J13.7 ; sheet lv_switch2/OUT3
NetC156A_1: J12.23 ; sheet lv_switch0/OUT4
NetC156C_1: J13.18 ; sheet lv_switch2/OUT4
NetC157A_1: J12.35 ; sheet lv_switch0/OUT5
NetC157C_1: J13.5 ; sheet lv_switch2/OUT5
NetJ7_1: J7.1(POS) XF6.1
NetJ12_2: J12.2 ; sheet sensor0/A_IN
NetJ12_5: J12.5 ; sheet sensor1/A_IN
NetJ12_9: J12.9 ; sheet digital1/D_IN
NetJ12_19: J12.19 ; sheet digital0/D_IN
NetJ13_13: J13.13 ; sheet digital2/D_IN
NetJ13_15: J13.15 ; sheet digital3/D_IN

Not connected (* = marked no-connect by the designer): J13 9 10 11 12

### Buses and harness runs
harness 10B-T1S_MDI = sheet eth_10base-t1s_phy/10B-T1S
harness CAN1_MDI = sheet can0/CAN_MDI
harness CAN2_MDI = sheet can1/CAN_MDI
harness ETH_P1 = sheet ethernet_switch/MDI_P1
harness ETH_P2 = sheet ethernet_switch/MDI_P2
harness ETH_P3 = sheet ethernet_switch/MDI_P3
harness MII_P7 = sheet eth_10base-t1s_phy/MII = sheet ethernet_switch/MII_P7
harness port CAN1 = sheet can0/CAN_MII
harness port CAN2 = sheet can1/CAN_MII
harness port RMII_P6 = sheet ethernet_switch/RMII_P6
harness port SMI = sheet eth_10base-t1s_phy/SMI
harness port SPI = sheet ethernet_switch/SPI = sheet lv_switch0/SPI = sheet lv_switch1/SPI = sheet lv_switch2/SPI

### Layout directives
differential pair; differential pair class DE_120: CAN1_MDI._N, CAN1_MDI._P, CAN2_MDI._N, CAN2_MDI._P
differential pair; differential pair class DE_100: 10B-T1S_MDI._N, 10B-T1S_MDI._P, ETH_P1.RX_N, ETH_P1.RX_P, ETH_P1.TX_N, ETH_P1.TX_P, ETH_P2.RX_N, ETH_P2.RX_P, ETH_P2.TX_N, ETH_P2.TX_P, ETH_P3.RX_N, ETH_P3.RX_P, ETH_P3.TX_N, ETH_P3.TX_P

### Notes on the sheet
- **Use with 16-20 AWG wire**
  Mating crimps 16-20 AWG: 770520-3
  Mating connector: 776164-5 (BLUE)
  Sealing plugs: 770678-1
  CPA: 2373965-1
  Backshell: 2389807-1
- **Use with 16-20 AWG wire**
  Mating crimps 16-20 AWG: 770520-3
  Mating connector: 776164-1 (BLACK)
  Sealing plugs: 770678-1
  CPA: 2373965-1
  Backshell: 2389807-1
- (in symbol CONN_AMPSEAL_35POS_RA_1-776163-1, part A) Black; Top row
- (in symbol CONN_AMPSEAL_35POS_RA_1-776163-1, part B) Black; Middle row
- (in symbol CONN_AMPSEAL_35POS_RA_1-776163-1, part C) Black; Bottom row
- (in symbol CONN_AMPSEAL_35POS_RA_1-776163-5, part A) Blue; Top row
- (in symbol CONN_AMPSEAL_35POS_RA_1-776163-5, part B) Blue; Middle row
- (in symbol CONN_AMPSEAL_35POS_RA_1-776163-5, part C) Blue; Bottom row
- (in symbol FUSEHOLDER_KEYSTONE_3568) ATM fuseholder
- (in symbol 1-776163-1, part A) Black; Top row
- (in symbol 1-776163-1, part B) Black; Middle row
- (in symbol 1-776163-1, part C) Black; Bottom row
- (in symbol 1-776163-5, part A) Blue; Top row
- (in symbol 1-776163-5, part B) Blue; Middle row
- (in symbol 1-776163-5, part C) Blue; Bottom row

### Library data of the parts
D12 = TVS_UNI_5.0SMDJ12A: TVS 5000W 12V UNIDIRECT SMCJ; Manufacturer: Littelfuse; ComponentLink1URL: https://www.littelfuse.com/media?resourcetype=datasheets&itemid=2b2f4a8c-2e81-4894-8d41-3d748bb79e68&filename=littelfuse-tvs-diode-5-0smdj-datasheet; ComponentLink1Description: Datasheet; Supplier 1: Digikey; Supplier Part Number 1: 5.0SMDJ12ACT-ND; Manufacturer Part Number: 5.0SMDJ12A; Supplier 2: LCSC; Supplier Part Number 2: C126819
J7 = CONN_AMASS_2POS_VERT_XT30UPB-M: Vertical PCB mount XT30 male; Manufacturer: Changzhou Amass Elec; Supplier 1: LCSC; Supplier Part Number 1: C428721; Manufacturer Part Number: XT30UPB-M; ComponentLink1Description: Datasheet; ComponentLink1URL: https://www.tme.com/Document/1191bc2fa3aee3c446e5a895fd8f7983/XT60PW-F.pdf
J12 = CONN_AMPSEAL_35POS_RA_1-776163-1: Conn Power PL 35 POS 4mm Solder RA Thru-Hole 35 Terminal 1 Port, BLACK; Manufacturer: TE Connectivity; Supplier 1: Digikey; Supplier Part Number 1: A106383-ND; Manufacturer Part Number: 1-776163-1; ComponentLink1Description: Product page; ComponentLink1URL: https://www.te.com/en/product-1-776163-1.html; ComponentLink2Description: Drawing; ComponentLink2URL: https://www.te.com/commerce/DocumentDelivery/DDEController?Action=showdoc&DocId=Customer+Drawing%7F776163%7FK%7Fpdf%7FEnglish%7FENG_CD_776163_K.pdf%7F1-776163-1; ComponentLink3Description: Application specification; ComponentLink3URL: https://www.te.com/commerce/DocumentDelivery/DDEController?Action=showdoc&DocId=Specification+Or+Standard%7F114-16016%7FR1%7Fpdf%7FEnglish%7FENG_SS_114-16016_R1.pdf%7F1-776163-1; Supplier 2: LCSC; Supplier Part Number 2: C596198; ComponentLink4Description: Series catalog; ComponentLink4URL: https://www.te.com/commerce/DocumentDelivery/DDEController?Action=showdoc&DocId=Data+Sheet%7F1-1773979-2%7FA%7Fpdf%7FEnglish%7FENG_DS_1-1773979-2_A.pdf%7F1-776280-1; ComponentLink5Description: Product specification; ComponentLink5URL: https://www.te.com/commerce/DocumentDelivery/DDEController?Action=showdoc&DocId=Specification+Or+Standard%7F108-1329%7FE1%7Fpdf%7FEnglish%7FENG_SS_108-1329_E1.pdf%7F1-776163-1
J13 = CONN_AMPSEAL_35POS_RA_1-776163-5: Conn Power PL 35 POS 4mm Solder RA Thru-Hole 35 Terminal 1 Port, BLUE; Manufacturer: TE Connectivity; Supplier 1: Digikey; Supplier Part Number 1: 1-776163-5-ND; Manufacturer Part Number: 1-776163-5; ComponentLink1Description: Product page; ComponentLink1URL: https://www.te.com/en/product-1-776163-5.html; ComponentLink2Description: Drawing; ComponentLink2URL: https://www.te.com/commerce/DocumentDelivery/DDEController?Action=showdoc&DocId=Customer+Drawing%7F776163%7FK%7Fpdf%7FEnglish%7FENG_CD_776163_K.pdf%7F1-776163-5; ComponentLink3Description: Application specification; ComponentLink3URL: https://www.te.com/commerce/DocumentDelivery/DDEController?Action=showdoc&DocId=Specification+Or+Standard%7F114-16016%7FR1%7Fpdf%7FEnglish%7FENG_SS_114-16016_R1.pdf%7F1-776163-5; Supplier 2: LCSC; Supplier Part Number 2: C17378321; ComponentLink4Description: Series catalog; ComponentLink4URL: https://www.te.com/commerce/DocumentDelivery/DDEController?Action=showdoc&DocId=Data+Sheet%7F1-1773979-2%7FA%7Fpdf%7FEnglish%7FENG_DS_1-1773979-2_A.pdf%7F1-776163-5; ComponentLink5Description: Product specification; ComponentLink5URL: https://www.te.com/commerce/DocumentDelivery/DDEController?Action=showdoc&DocId=Specification+Or+Standard%7F108-1329%7FE1%7Fpdf%7FEnglish%7FENG_SS_108-1329_E1.pdf%7F1-776163-5
XF6 = FUSEHOLDER_KEYSTONE_3568: Fuse Holder 30 A 500V 1 Circuit Blade Through Hole; Manufacturer: Keystone Electronics; Supplier 1: Digikey; Supplier Part Number 1: 36-3568-ND; Manufacturer Part Number: 3568; ComponentLink1URL: https://www.keyelco.com/userAssets/file/M65p42.pdf; ComponentLink1Description: Datasheet; Supplier 2: LCSC; Supplier Part Number 2: C3206956